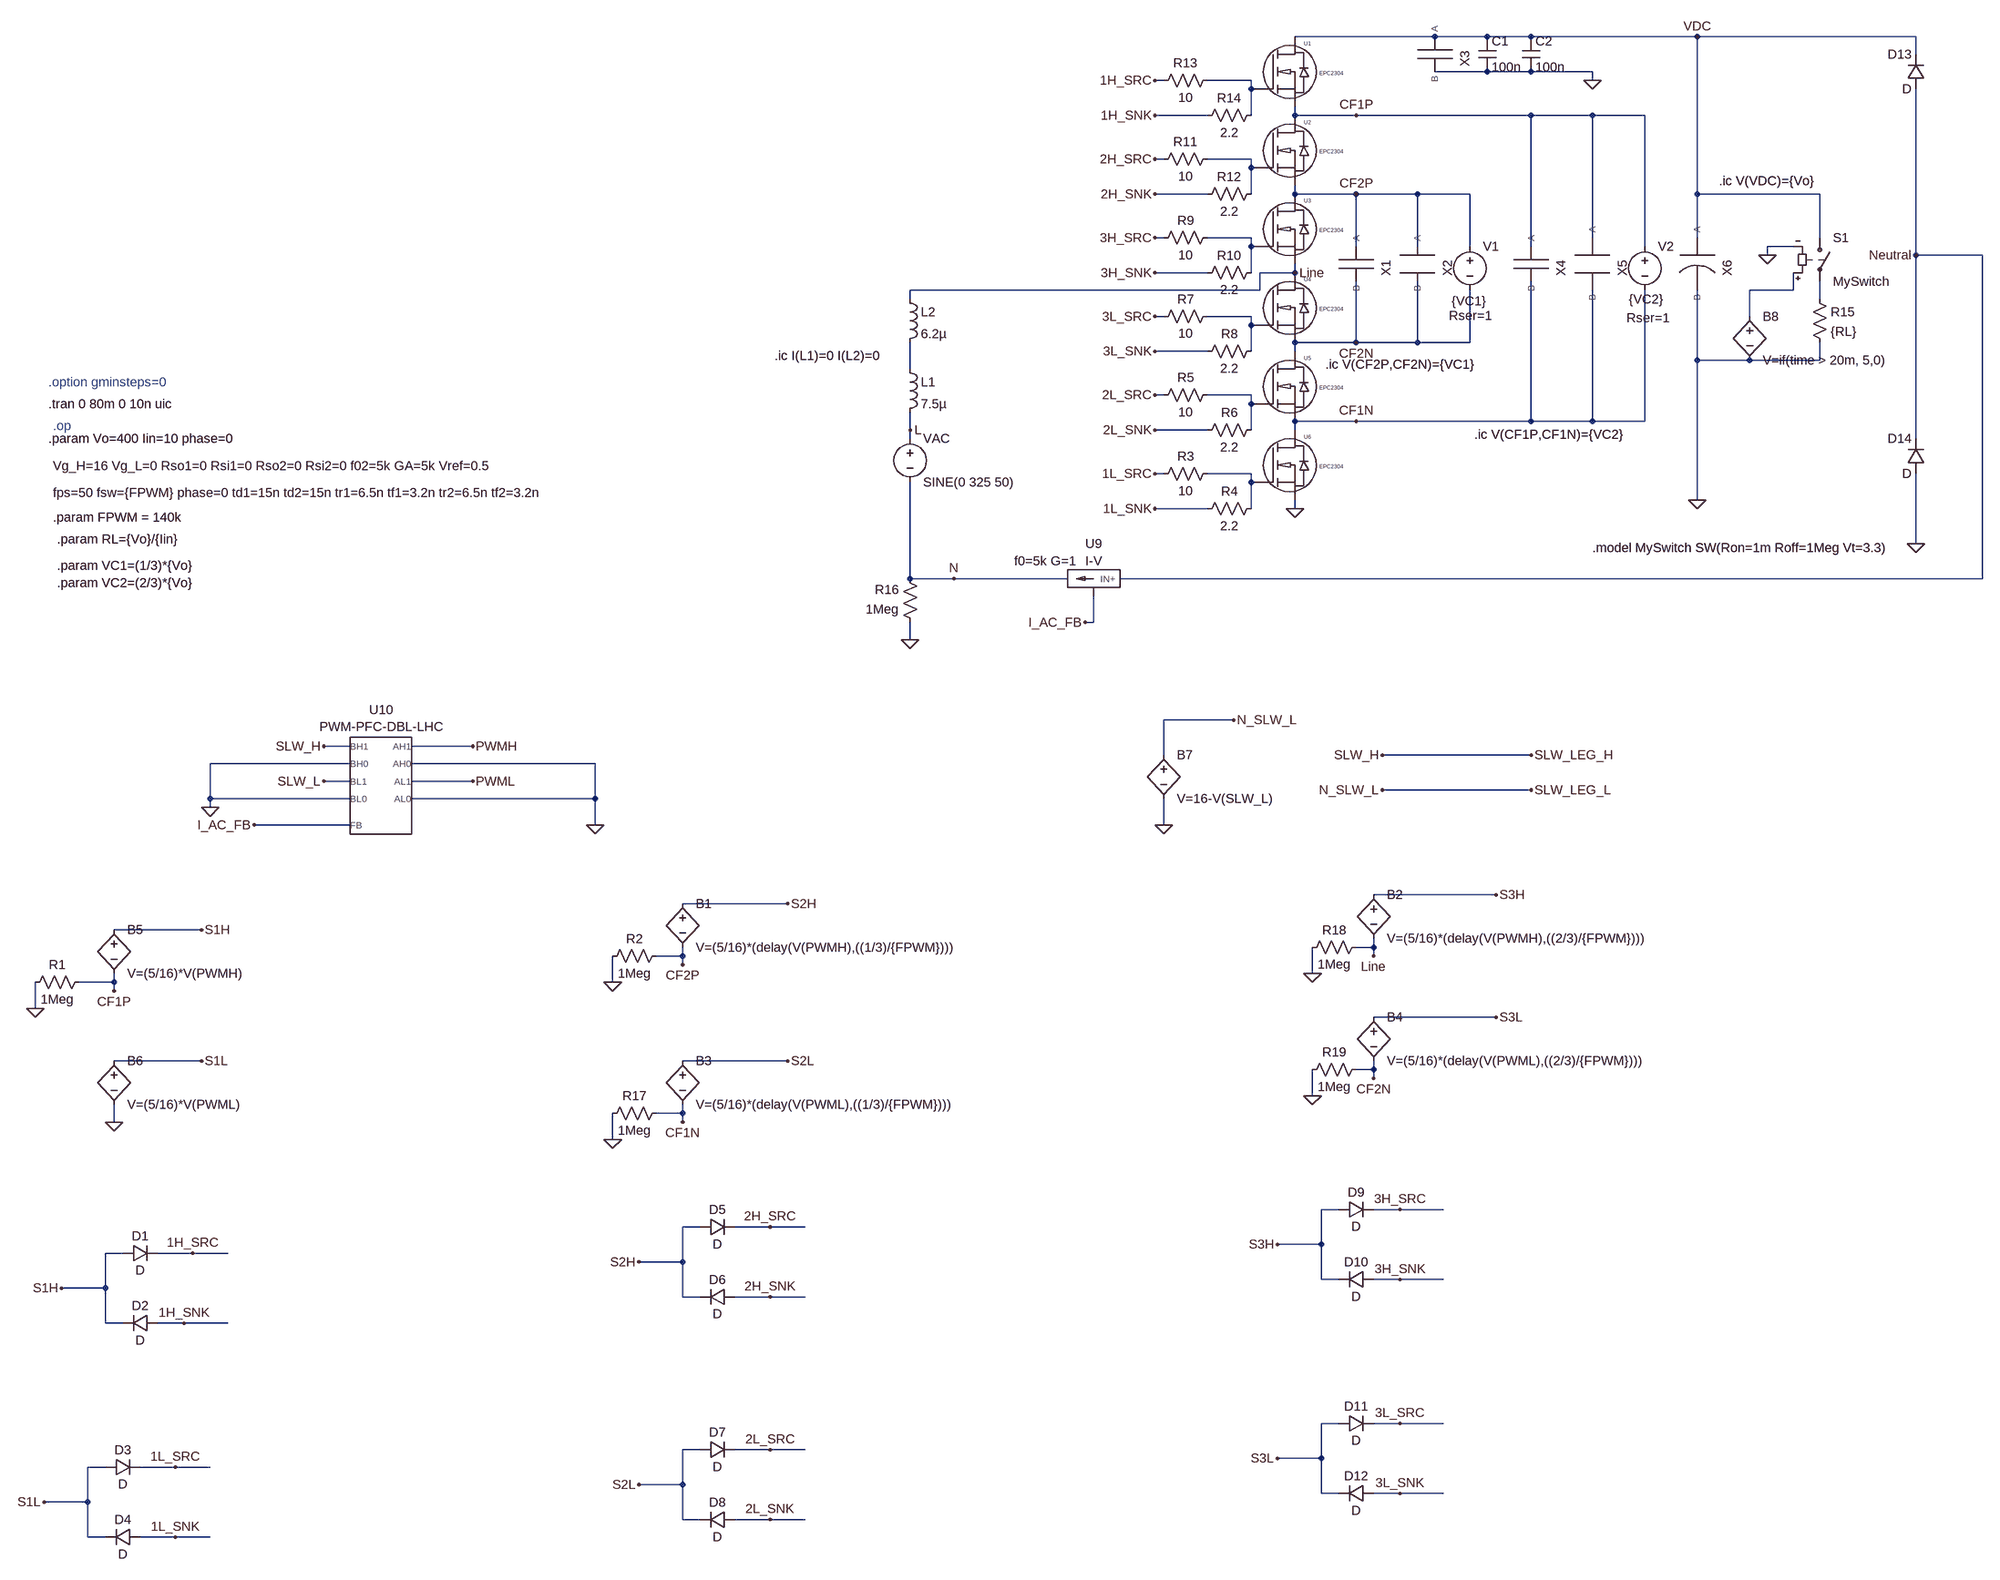
[diagram p0: schematic PFC_ZVS.asc]
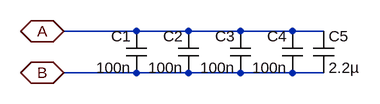
[diagram p1: sub-circuit hf_decoup.asc]
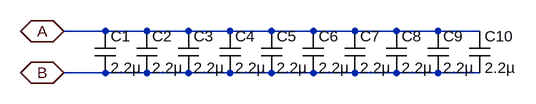
[diagram p2: sub-circuit fl2.asc]
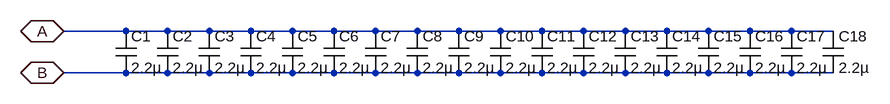
[diagram p3: sub-circuit fl1.asc]
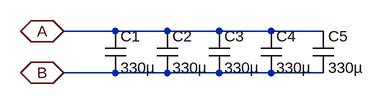
[diagram p4: sub-circuit bulk_cap.asc]
PFC_ZVS.asc, the LTspice schematic file:
Version 4.1
SHEET 1 4276 2968
WIRE 352 0 96 0
WIRE 448 0 352 0
WIRE 528 0 448 0
WIRE 832 0 528 0
WIRE 1232 0 832 0
WIRE 1232 32 1232 0
WIRE 448 64 352 64
WIRE 528 64 448 64
WIRE 640 64 528 64
WIRE -144 80 -160 80
WIRE 16 80 -64 80
WIRE 640 80 640 64
WIRE 16 96 16 80
WIRE -64 144 -160 144
WIRE 16 144 16 96
WIRE 96 144 96 128
WIRE 208 144 96 144
WIRE 528 144 208 144
WIRE 640 144 528 144
WIRE 736 144 640 144
WIRE -144 224 -160 224
WIRE 16 224 -64 224
WIRE 16 240 16 224
WIRE -64 288 -160 288
WIRE 16 288 16 240
WIRE 96 288 96 272
WIRE 208 288 96 288
WIRE 320 288 208 288
WIRE 416 288 320 288
WIRE 832 288 832 0
WIRE 1056 288 832 288
WIRE -144 368 -160 368
WIRE 16 368 -64 368
WIRE 640 368 640 144
WIRE 832 368 832 288
WIRE 1056 368 1056 288
WIRE 16 384 16 368
WIRE 208 384 208 288
WIRE 320 384 320 288
WIRE 416 384 416 288
WIRE 528 384 528 144
WIRE 736 384 736 144
WIRE 1008 384 960 384
WIRE 960 400 960 384
WIRE 1232 400 1232 96
WIRE 1792 400 1232 400
WIRE -64 432 -160 432
WIRE 16 432 16 384
WIRE 96 432 96 416
WIRE 96 432 32 432
WIRE 32 464 32 432
WIRE 32 464 -608 464
WIRE 1008 464 1008 432
WIRE 1008 464 928 464
WIRE -608 480 -608 464
WIRE 1056 480 1056 448
WIRE -144 512 -160 512
WIRE 16 512 -64 512
WIRE 928 512 928 464
WIRE 16 528 16 512
WIRE 208 560 208 448
WIRE 208 560 96 560
WIRE 320 560 320 448
WIRE 320 560 208 560
WIRE 416 560 416 464
WIRE 416 560 320 560
WIRE -64 576 -160 576
WIRE 16 576 16 528
WIRE 96 576 96 560
WIRE 832 592 832 464
WIRE 928 592 832 592
WIRE 1056 592 1056 560
WIRE 1056 592 928 592
WIRE -608 608 -608 560
WIRE -144 656 -160 656
WIRE 16 656 -64 656
WIRE 16 672 16 656
WIRE 208 704 96 704
WIRE 528 704 528 448
WIRE 528 704 208 704
WIRE 640 704 640 464
WIRE 640 704 528 704
WIRE 736 704 736 464
WIRE 736 704 640 704
WIRE -608 720 -608 688
WIRE -64 720 -160 720
WIRE 16 720 16 672
WIRE 96 720 96 704
WIRE -608 736 -608 720
WIRE 1232 736 1232 400
WIRE -144 800 -160 800
WIRE 16 800 -64 800
WIRE 16 816 16 800
WIRE 832 848 832 592
WIRE -64 864 -160 864
WIRE 16 864 16 816
WIRE 96 864 96 848
WIRE 1232 928 1232 800
WIRE -608 992 -608 816
WIRE -528 992 -608 992
WIRE -320 992 -528 992
WIRE 1792 992 1792 400
WIRE 1792 992 -224 992
WIRE -272 1072 -272 1024
WIRE -272 1072 -288 1072
WIRE -608 1104 -608 1072
WIRE -16 1296 -144 1296
WIRE -1632 1344 -1680 1344
WIRE -1408 1344 -1520 1344
WIRE -144 1360 -144 1296
WIRE 528 1360 256 1360
WIRE -1632 1376 -1888 1376
WIRE -1184 1376 -1520 1376
WIRE -1632 1408 -1680 1408
WIRE -1408 1408 -1520 1408
WIRE 528 1424 256 1424
WIRE -1888 1440 -1888 1376
WIRE -1632 1440 -1888 1440
WIRE -1184 1440 -1184 1376
WIRE -1184 1440 -1520 1440
WIRE -1888 1456 -1888 1440
WIRE -1632 1488 -1808 1488
WIRE -1184 1488 -1184 1440
WIRE -144 1488 -144 1440
WIRE 464 1616 240 1616
WIRE -832 1632 -1024 1632
WIRE -1904 1680 -2064 1680
WIRE 240 1712 240 1696
WIRE 240 1712 208 1712
WIRE -1024 1728 -1024 1712
WIRE -1024 1728 -1072 1728
WIRE 240 1728 240 1712
WIRE -1024 1744 -1024 1728
WIRE 128 1760 128 1712
WIRE -2064 1776 -2064 1760
WIRE -2064 1776 -2128 1776
WIRE -1152 1776 -1152 1728
WIRE -2064 1792 -2064 1776
WIRE -2208 1824 -2208 1776
WIRE 464 1840 240 1840
WIRE -1904 1920 -2064 1920
WIRE -832 1920 -1024 1920
WIRE 240 1936 240 1920
WIRE 240 1936 208 1936
WIRE 240 1952 240 1936
WIRE 128 1984 128 1936
WIRE -1024 2016 -1024 2000
WIRE -1024 2016 -1072 2016
WIRE -2064 2032 -2064 2000
WIRE -1024 2032 -1024 2016
WIRE -1152 2064 -1152 2016
WIRE 176 2192 144 2192
WIRE 288 2192 240 2192
WIRE 368 2192 288 2192
WIRE -992 2224 -1024 2224
WIRE -864 2224 -928 2224
WIRE -800 2224 -864 2224
WIRE 144 2256 144 2192
WIRE 144 2256 64 2256
WIRE -2048 2272 -2080 2272
WIRE -1920 2272 -1984 2272
WIRE -1856 2272 -1920 2272
WIRE -1024 2288 -1024 2224
WIRE -1024 2288 -1104 2288
WIRE 144 2320 144 2256
WIRE 176 2320 144 2320
WIRE 288 2320 240 2320
WIRE 368 2320 288 2320
WIRE -2080 2336 -2080 2272
WIRE -2080 2336 -2160 2336
WIRE -1024 2352 -1024 2288
WIRE -992 2352 -1024 2352
WIRE -864 2352 -928 2352
WIRE -800 2352 -864 2352
WIRE -2080 2400 -2080 2336
WIRE -2048 2400 -2080 2400
WIRE -1936 2400 -1984 2400
WIRE -1856 2400 -1936 2400
WIRE 176 2592 144 2592
WIRE 288 2592 240 2592
WIRE 368 2592 288 2592
WIRE -992 2640 -1024 2640
WIRE -864 2640 -928 2640
WIRE -800 2640 -864 2640
WIRE 144 2656 144 2592
WIRE 144 2656 64 2656
WIRE -2080 2672 -2112 2672
WIRE -1952 2672 -2016 2672
WIRE -1888 2672 -1952 2672
WIRE -1024 2704 -1024 2640
WIRE -1024 2704 -1104 2704
WIRE 144 2720 144 2656
WIRE 176 2720 144 2720
WIRE 288 2720 240 2720
WIRE 368 2720 288 2720
WIRE -2112 2736 -2112 2672
WIRE -2112 2736 -2192 2736
WIRE -1024 2768 -1024 2704
WIRE -992 2768 -1024 2768
WIRE -864 2768 -928 2768
WIRE -800 2768 -864 2768
WIRE -2112 2800 -2112 2736
WIRE -2080 2800 -2112 2800
WIRE -1952 2800 -2016 2800
WIRE -1888 2800 -1952 2800
FLAG 96 864 0
FLAG 1232 928 0
FLAG 640 80 0
FLAG 832 848 0
FLAG -288 1072 I_AC_FB
FLAG -1808 1488 I_AC_FB
FLAG -1184 1488 0
FLAG 1232 400 Neutral
FLAG -1408 1344 PWMH
FLAG -1408 1408 PWML
FLAG 208 144 CF1P
FLAG 208 288 CF2P
FLAG 208 560 CF2N
FLAG 208 704 CF1N
FLAG -1904 1680 S1H
FLAG -1904 1920 S1L
FLAG -832 1632 S2H
FLAG -832 1920 S2L
FLAG 464 1616 S3H
FLAG 464 1840 S3L
FLAG -160 80 1H_SRC
FLAG -160 144 1H_SNK
FLAG -160 224 2H_SRC
FLAG -160 288 2H_SNK
FLAG -160 368 3H_SRC
FLAG -160 432 3H_SNK
FLAG -160 512 3L_SRC
FLAG -160 576 3L_SNK
FLAG -160 656 2L_SRC
FLAG -160 720 2L_SNK
FLAG -160 800 1L_SRC
FLAG -160 864 1L_SNK
FLAG -2160 2336 S1H
FLAG -1920 2272 1H_SRC
FLAG -1936 2400 1H_SNK
FLAG -2192 2736 S1L
FLAG -1952 2672 1L_SRC
FLAG -1952 2800 1L_SNK
FLAG -1104 2288 S2H
FLAG -864 2224 2H_SRC
FLAG -864 2352 2H_SNK
FLAG -1104 2704 S2L
FLAG -864 2640 2L_SRC
FLAG -864 2768 2L_SNK
FLAG 64 2256 S3H
FLAG 288 2192 3H_SRC
FLAG 288 2320 3H_SNK
FLAG 96 432 Line
FLAG 64 2656 S3L
FLAG 288 2592 3L_SRC
FLAG 288 2720 3L_SNK
FLAG 832 0 VDC
FLAG 528 1424 SLW_LEG_L
FLAG 528 1360 SLW_LEG_H
FLAG -1888 1456 0
FLAG -1680 1344 SLW_H
FLAG -1680 1408 SLW_L
FLAG 256 1360 SLW_H
FLAG -144 1488 0
FLAG -16 1296 N_SLW_L
FLAG 256 1424 N_SLW_L
FLAG -608 720 L
FLAG -528 992 N
FLAG -608 1104 0
FLAG -1024 2032 CF1N
FLAG -2064 2032 0
FLAG 240 1952 CF2N
FLAG 240 1728 Line
FLAG -1024 1744 CF2P
FLAG -2064 1792 CF1P
FLAG -2208 1824 0
FLAG -1152 1776 0
FLAG -1152 2064 0
FLAG 128 1760 0
FLAG 128 1984 0
FLAG 960 400 0
SYMBOL EPCGaN 16 96 R0
SYMATTR InstName U1
SYMBOL EPCGaN 16 240 R0
SYMATTR InstName U2
SYMBOL EPCGaN 16 384 R0
SYMATTR InstName U3
SYMBOL EPCGaN 16 528 R0
SYMATTR InstName U4
SYMBOL EPCGaN 16 672 R0
SYMATTR InstName U5
SYMBOL EPCGaN 16 816 R0
SYMATTR InstName U6
SYMBOL voltage -608 720 R0
WINDOW 123 0 0 Left 0
WINDOW 39 24 124 Left 2
SYMATTR InstName VAC
SYMATTR Value SINE(0 325 50)
SYMBOL ind -624 592 R0
SYMATTR InstName L1
SYMATTR Value 7.5µ
SYMATTR SpiceLine Ipk=96 Rser=2.11m Rpar=3.209k Cpar=4p
SYMBOL HF_decoup 208 416 R90
SYMATTR InstName X1
SYMBOL FL2 320 416 R90
SYMATTR InstName X2
SYMBOL HF_decoup 352 32 R90
SYMATTR InstName X3
SYMBOL cap 432 0 R0
SYMATTR InstName C1
SYMATTR Value 100n
SYMATTR SpiceLine V=450 Rser=0.0242 Lser=0.75n Rpar=5Giga
SYMBOL cap 512 0 R0
SYMATTR InstName C2
SYMATTR Value 100n
SYMATTR SpiceLine V=450 Rser=0.0242 Lser=0.75n Rpar=5Giga
SYMBOL HF_decoup 528 416 R90
SYMATTR InstName X4
SYMBOL FL1 640 416 R90
SYMATTR InstName X5
SYMBOL Bulk_cap 832 416 R90
SYMATTR InstName X6
SYMBOL I-V -288 992 M0
SYMATTR InstName U9
SYMBOL ind -624 464 R0
SYMATTR InstName L2
SYMATTR Value 6.2µ
SYMATTR SpiceLine Ipk=74 Rser=1.05m Rpar=1.5k Cpar=6.5p
SYMBOL PWM-PFC-DBL-LHC -1584 1472 R0
WINDOW 39 -592 -637 Left 2
WINDOW 40 -592 -686 Left 2
SYMATTR SpiceLine fps=50 fsw={FPWM} phase=0 td1=15n td2=15n tr1=6.5n tf1=3.2n tr2=6.5n tf2=3.2n
SYMATTR SpiceLine2 Vg_H=16 Vg_L=0 Rso1=0 Rsi1=0 Rso2=0 Rsi2=0 f02=5k GA=5k Vref=0.5
SYMATTR InstName U10
SYMBOL bv -1024 1616 R0
SYMATTR InstName B1
SYMATTR Value V=(5/16)*(delay(V(PWMH),((1/3)/{FPWM})))
SYMBOL res -48 784 R90
WINDOW 0 0 56 VBottom 2
WINDOW 3 32 56 VTop 2
SYMATTR InstName R3
SYMATTR Value 10
SYMBOL res 32 848 R90
WINDOW 0 0 56 VBottom 2
WINDOW 3 32 56 VTop 2
SYMATTR InstName R4
SYMATTR Value 2.2
SYMBOL res -48 640 R90
WINDOW 0 0 56 VBottom 2
WINDOW 3 32 56 VTop 2
SYMATTR InstName R5
SYMATTR Value 10
SYMBOL res 32 704 R90
WINDOW 0 0 56 VBottom 2
WINDOW 3 32 56 VTop 2
SYMATTR InstName R6
SYMATTR Value 2.2
SYMBOL res -48 496 R90
WINDOW 0 0 56 VBottom 2
WINDOW 3 32 56 VTop 2
SYMATTR InstName R7
SYMATTR Value 10
SYMBOL res 32 560 R90
WINDOW 0 0 56 VBottom 2
WINDOW 3 32 56 VTop 2
SYMATTR InstName R8
SYMATTR Value 2.2
SYMBOL res -48 352 R90
WINDOW 0 0 56 VBottom 2
WINDOW 3 32 56 VTop 2
SYMATTR InstName R9
SYMATTR Value 10
SYMBOL res 32 416 R90
WINDOW 0 0 56 VBottom 2
WINDOW 3 32 56 VTop 2
SYMATTR InstName R10
SYMATTR Value 2.2
SYMBOL res -48 208 R90
WINDOW 0 0 56 VBottom 2
WINDOW 3 32 56 VTop 2
SYMATTR InstName R11
SYMATTR Value 10
SYMBOL res 32 272 R90
WINDOW 0 0 56 VBottom 2
WINDOW 3 32 56 VTop 2
SYMATTR InstName R12
SYMATTR Value 2.2
SYMBOL res -48 64 R90
WINDOW 0 0 56 VBottom 2
WINDOW 3 32 56 VTop 2
SYMATTR InstName R13
SYMATTR Value 10
SYMBOL res 32 128 R90
WINDOW 0 0 56 VBottom 2
WINDOW 3 32 56 VTop 2
SYMATTR InstName R14
SYMATTR Value 2.2
SYMBOL bv -1024 1904 R0
SYMATTR InstName B3
SYMATTR Value V=(5/16)*(delay(V(PWML),((1/3)/{FPWM})))
SYMBOL bv 240 1600 R0
SYMATTR InstName B2
SYMATTR Value V=(5/16)*(delay(V(PWMH),((2/3)/{FPWM})))
SYMBOL bv 240 1824 R0
SYMATTR InstName B4
SYMATTR Value V=(5/16)*(delay(V(PWML),((2/3)/{FPWM})))
SYMBOL bv -2064 1664 R0
SYMATTR InstName B5
SYMATTR Value V=(5/16)*V(PWMH)
SYMBOL bv -2064 1904 R0
SYMATTR InstName B6
SYMATTR Value V=(5/16)*V(PWML)
SYMBOL res 1040 464 R0
SYMATTR InstName R15
SYMATTR Value {RL}
SYMBOL bv -144 1344 R0
SYMATTR InstName B7
SYMATTR Value V=16-V(SLW_L)
SYMBOL res -592 1088 R180
WINDOW 0 36 76 Left 2
WINDOW 3 36 40 Left 2
SYMATTR InstName R16
SYMATTR Value 1Meg
SYMBOL diode -2048 2288 R270
WINDOW 0 32 32 VTop 2
WINDOW 3 0 32 VBottom 2
SYMATTR InstName D1
SYMBOL diode -1984 2384 R90
WINDOW 0 0 32 VBottom 2
WINDOW 3 32 32 VTop 2
SYMATTR InstName D2
SYMBOL diode -2080 2688 R270
WINDOW 0 32 32 VTop 2
WINDOW 3 0 32 VBottom 2
SYMATTR InstName D3
SYMBOL diode -2016 2784 R90
WINDOW 0 0 32 VBottom 2
WINDOW 3 32 32 VTop 2
SYMATTR InstName D4
SYMBOL diode -992 2240 R270
WINDOW 0 32 32 VTop 2
WINDOW 3 0 32 VBottom 2
SYMATTR InstName D5
SYMBOL diode -928 2336 R90
WINDOW 0 0 32 VBottom 2
WINDOW 3 32 32 VTop 2
SYMATTR InstName D6
SYMBOL diode -992 2656 R270
WINDOW 0 32 32 VTop 2
WINDOW 3 0 32 VBottom 2
SYMATTR InstName D7
SYMBOL diode -928 2752 R90
WINDOW 0 0 32 VBottom 2
WINDOW 3 32 32 VTop 2
SYMATTR InstName D8
SYMBOL diode 176 2208 R270
WINDOW 0 32 32 VTop 2
WINDOW 3 0 32 VBottom 2
SYMATTR InstName D9
SYMBOL diode 240 2304 R90
WINDOW 0 0 32 VBottom 2
WINDOW 3 32 32 VTop 2
SYMATTR InstName D10
SYMBOL diode 176 2608 R270
WINDOW 0 32 32 VTop 2
WINDOW 3 0 32 VBottom 2
SYMATTR InstName D11
SYMBOL diode 240 2704 R90
WINDOW 0 0 32 VBottom 2
WINDOW 3 32 32 VTop 2
SYMATTR InstName D12
SYMBOL diode 1248 96 R180
WINDOW 0 24 64 Left 2
WINDOW 3 24 0 Left 2
SYMATTR InstName D13
SYMBOL diode 1248 800 R180
WINDOW 0 24 64 Left 2
WINDOW 3 24 0 Left 2
SYMATTR InstName D14
SYMBOL res -2112 1760 R90
WINDOW 0 0 56 VBottom 2
WINDOW 3 32 56 VTop 2
SYMATTR InstName R1
SYMATTR Value 1Meg
SYMBOL res -1056 1712 R90
WINDOW 0 0 56 VBottom 2
WINDOW 3 32 56 VTop 2
SYMATTR InstName R2
SYMATTR Value 1Meg
SYMBOL res -1056 2000 R90
WINDOW 0 0 56 VBottom 2
WINDOW 3 32 56 VTop 2
SYMATTR InstName R17
SYMATTR Value 1Meg
SYMBOL res 224 1696 R90
WINDOW 0 0 56 VBottom 2
WINDOW 3 32 56 VTop 2
SYMATTR InstName R18
SYMATTR Value 1Meg
SYMBOL res 224 1920 R90
WINDOW 0 0 56 VBottom 2
WINDOW 3 32 56 VTop 2
SYMATTR InstName R19
SYMATTR Value 1Meg
SYMBOL sw 1056 352 R0
SYMATTR InstName S1
SYMATTR Value MySwitch
SYMBOL bv 928 496 R0
SYMATTR InstName B8
SYMATTR Value V=if(time > 20m, 5,0)
SYMBOL voltage 416 368 R0
WINDOW 3 -33 116 Left 2
WINDOW 123 0 0 Left 0
WINDOW 39 -38 143 Left 2
SYMATTR InstName V1
SYMATTR Value {VC1}
SYMATTR SpiceLine Rser=1
SYMBOL voltage 736 368 R0
WINDOW 3 -29 113 Left 2
WINDOW 123 0 0 Left 0
WINDOW 39 -33 147 Left 2
SYMATTR InstName V2
SYMATTR Value {VC2}
SYMATTR SpiceLine Rser=1
TEXT -2184 672 Left 2 !.tran 0 80m 0 10n uic
TEXT 152 600 Left 2 !.ic V(CF2P,CF2N)={VC1}
TEXT 424 728 Left 2 !.ic V(CF1P,CF1N)={VC2}
TEXT 872 264 Left 2 !.ic V(VDC)={Vo}
TEXT -856 584 Left 2 !.ic I(L1)=0 I(L2)=0
TEXT -2176 712 Left 2 ;.op
TEXT -2184 736 Left 2 !.param Vo=400 Iin=10 phase=0
TEXT -2176 880 Left 2 !.param FPWM = 140k
TEXT -2184 632 Left 2 ;.option gminsteps=0
TEXT -2168 920 Left 2 !.param RL={Vo}/{Iin}
TEXT 640 936 Left 2 !.model MySwitch SW(Ron=1m Roff=1Meg Vt=3.3)
TEXT -2168 968 Left 2 !.param VC1=(1/3)*{Vo}
TEXT -2168 1000 Left 2 !.param VC2=(2/3)*{Vo}

hf_decoup.asc, the sub-circuit schematic file:
Version 4.1
SHEET 1 880 680
WIRE 192 96 80 96
WIRE 272 96 192 96
WIRE 352 96 272 96
WIRE 432 96 352 96
WIRE 480 96 432 96
WIRE 192 160 80 160
WIRE 272 160 192 160
WIRE 352 160 272 160
WIRE 432 160 352 160
WIRE 480 160 432 160
FLAG 80 96 A
IOPIN 80 96 BiDir
FLAG 80 160 B
IOPIN 80 160 BiDir
SYMBOL cap 208 160 R180
WINDOW 0 24 56 Left 2
WINDOW 3 24 8 Left 2
SYMATTR InstName C1
SYMATTR Value 100n
SYMATTR SpiceLine V=450 Rser=0.0242 Lser=0.75n Rpar=5G
SYMBOL cap 288 160 R180
WINDOW 0 24 56 Left 2
WINDOW 3 24 8 Left 2
SYMATTR InstName C2
SYMATTR Value 100n
SYMATTR SpiceLine V=450 Rser=0.0242 Lser=0.75n Rpar=5G
SYMBOL cap 368 160 R180
WINDOW 0 24 56 Left 2
WINDOW 3 24 8 Left 2
SYMATTR InstName C3
SYMATTR Value 100n
SYMATTR SpiceLine V=450 Rser=0.0242 Lser=0.75n Rpar=5G
SYMBOL cap 448 160 R180
WINDOW 0 24 56 Left 2
WINDOW 3 24 8 Left 2
SYMATTR InstName C4
SYMATTR Value 100n
SYMATTR SpiceLine V=450 Rser=0.0242 Lser=0.75n Rpar=5G
SYMBOL cap 464 96 R0
SYMATTR InstName C5
SYMATTR Value 2.2µ
SYMATTR SpiceLine V=450 Rser=0.0043 Lser=0.65n Rpar=0.227G

fl2.asc, the sub-circuit schematic file:
Version 4.1
SHEET 1 880 680
WIRE 128 96 64 96
WIRE 192 96 128 96
WIRE 256 96 192 96
WIRE 320 96 256 96
WIRE 384 96 320 96
WIRE 448 96 384 96
WIRE 512 96 448 96
WIRE 576 96 512 96
WIRE 640 96 576 96
WIRE 704 96 640 96
WIRE 128 160 64 160
WIRE 192 160 128 160
WIRE 256 160 192 160
WIRE 320 160 256 160
WIRE 384 160 320 160
WIRE 448 160 384 160
WIRE 512 160 448 160
WIRE 576 160 512 160
WIRE 640 160 576 160
WIRE 704 160 640 160
FLAG 64 96 A
IOPIN 64 96 BiDir
FLAG 64 160 B
IOPIN 64 160 BiDir
SYMBOL cap 112 96 R0
SYMATTR InstName C1
SYMATTR Value 2.2µ
SYMATTR SpiceLine V=450 Rser=0.0043 Lser=0.65n Rpar=0.227G
SYMBOL cap 176 96 R0
SYMATTR InstName C2
SYMATTR Value 2.2µ
SYMATTR SpiceLine V=450 Rser=0.0043 Lser=0.65n Rpar=0.227G
SYMBOL cap 240 96 R0
SYMATTR InstName C3
SYMATTR Value 2.2µ
SYMATTR SpiceLine V=450 Rser=0.0043 Lser=0.65n Rpar=0.227G
SYMBOL cap 304 96 R0
SYMATTR InstName C4
SYMATTR Value 2.2µ
SYMATTR SpiceLine V=450 Rser=0.0043 Lser=0.65n Rpar=0.227G
SYMBOL cap 368 96 R0
SYMATTR InstName C5
SYMATTR Value 2.2µ
SYMATTR SpiceLine V=450 Rser=0.0043 Lser=0.65n Rpar=0.227G
SYMBOL cap 432 96 R0
SYMATTR InstName C6
SYMATTR Value 2.2µ
SYMATTR SpiceLine V=450 Rser=0.0043 Lser=0.65n Rpar=0.227G
SYMBOL cap 496 96 R0
SYMATTR InstName C7
SYMATTR Value 2.2µ
SYMATTR SpiceLine V=450 Rser=0.0043 Lser=0.65n Rpar=0.227G
SYMBOL cap 560 96 R0
SYMATTR InstName C8
SYMATTR Value 2.2µ
SYMATTR SpiceLine V=450 Rser=0.0043 Lser=0.65n Rpar=0.227G
SYMBOL cap 624 96 R0
SYMATTR InstName C9
SYMATTR Value 2.2µ
SYMATTR SpiceLine V=450 Rser=0.0043 Lser=0.65n Rpar=0.227G
SYMBOL cap 688 96 R0
SYMATTR InstName C10
SYMATTR Value 2.2µ
SYMATTR SpiceLine V=450 Rser=0.0043 Lser=0.65n Rpar=0.227G

fl1.asc, the sub-circuit schematic file:
Version 4.1
SHEET 1 1280 680
WIRE 128 112 32 112
WIRE 192 112 128 112
WIRE 256 112 192 112
WIRE 320 112 256 112
WIRE 384 112 320 112
WIRE 448 112 384 112
WIRE 512 112 448 112
WIRE 576 112 512 112
WIRE 640 112 576 112
WIRE 704 112 640 112
WIRE 768 112 704 112
WIRE 832 112 768 112
WIRE 896 112 832 112
WIRE 960 112 896 112
WIRE 1024 112 960 112
WIRE 1088 112 1024 112
WIRE 1152 112 1088 112
WIRE 1216 112 1152 112
WIRE 128 176 32 176
WIRE 192 176 128 176
WIRE 256 176 192 176
WIRE 320 176 256 176
WIRE 384 176 320 176
WIRE 448 176 384 176
WIRE 512 176 448 176
WIRE 576 176 512 176
WIRE 640 176 576 176
WIRE 704 176 640 176
WIRE 768 176 704 176
WIRE 832 176 768 176
WIRE 896 176 832 176
WIRE 960 176 896 176
WIRE 1024 176 960 176
WIRE 1088 176 1024 176
WIRE 1152 176 1088 176
WIRE 1216 176 1152 176
FLAG 32 112 A
IOPIN 32 112 BiDir
FLAG 32 176 B
IOPIN 32 176 BiDir
SYMBOL cap 112 112 R0
SYMATTR InstName C1
SYMATTR Value 2.2µ
SYMATTR SpiceLine V=450 Rser=0.0043 Lser=0.65n Rpar=0.227G
SYMBOL cap 176 112 R0
SYMATTR InstName C2
SYMATTR Value 2.2µ
SYMATTR SpiceLine V=450 Rser=0.0043 Lser=0.65n Rpar=0.227G
SYMBOL cap 240 112 R0
SYMATTR InstName C3
SYMATTR Value 2.2µ
SYMATTR SpiceLine V=450 Rser=0.0043 Lser=0.65n Rpar=0.227G
SYMBOL cap 304 112 R0
SYMATTR InstName C4
SYMATTR Value 2.2µ
SYMATTR SpiceLine V=450 Rser=0.0043 Lser=0.65n Rpar=0.227G
SYMBOL cap 368 112 R0
SYMATTR InstName C5
SYMATTR Value 2.2µ
SYMATTR SpiceLine V=450 Rser=0.0043 Lser=0.65n Rpar=0.227G
SYMBOL cap 432 112 R0
SYMATTR InstName C6
SYMATTR Value 2.2µ
SYMATTR SpiceLine V=450 Rser=0.0043 Lser=0.65n Rpar=0.227G
SYMBOL cap 496 112 R0
SYMATTR InstName C7
SYMATTR Value 2.2µ
SYMATTR SpiceLine V=450 Rser=0.0043 Lser=0.65n Rpar=0.227G
SYMBOL cap 560 112 R0
SYMATTR InstName C8
SYMATTR Value 2.2µ
SYMATTR SpiceLine V=450 Rser=0.0043 Lser=0.65n Rpar=0.227G
SYMBOL cap 624 112 R0
SYMATTR InstName C9
SYMATTR Value 2.2µ
SYMATTR SpiceLine V=450 Rser=0.0043 Lser=0.65n Rpar=0.227G
SYMBOL cap 688 112 R0
SYMATTR InstName C10
SYMATTR Value 2.2µ
SYMATTR SpiceLine V=450 Rser=0.0043 Lser=0.65n Rpar=0.227G
SYMBOL cap 752 112 R0
SYMATTR InstName C11
SYMATTR Value 2.2µ
SYMATTR SpiceLine V=450 Rser=0.0043 Lser=0.65n Rpar=0.227G
SYMBOL cap 816 112 R0
SYMATTR InstName C12
SYMATTR Value 2.2µ
SYMATTR SpiceLine V=450 Rser=0.0043 Lser=0.65n Rpar=0.227G
SYMBOL cap 880 112 R0
SYMATTR InstName C13
SYMATTR Value 2.2µ
SYMATTR SpiceLine V=450 Rser=0.0043 Lser=0.65n Rpar=0.227G
SYMBOL cap 944 112 R0
SYMATTR InstName C14
SYMATTR Value 2.2µ
SYMATTR SpiceLine V=450 Rser=0.0043 Lser=0.65n Rpar=0.227G
SYMBOL cap 1008 112 R0
SYMATTR InstName C15
SYMATTR Value 2.2µ
SYMATTR SpiceLine V=450 Rser=0.0043 Lser=0.65n Rpar=0.227G
SYMBOL cap 1072 112 R0
SYMATTR InstName C16
SYMATTR Value 2.2µ
SYMATTR SpiceLine V=450 Rser=0.0043 Lser=0.65n Rpar=0.227G
SYMBOL cap 1136 112 R0
SYMATTR InstName C17
SYMATTR Value 2.2µ
SYMATTR SpiceLine V=450 Rser=0.0043 Lser=0.65n Rpar=0.227G
SYMBOL cap 1200 112 R0
SYMATTR InstName C18
SYMATTR Value 2.2µ
SYMATTR SpiceLine V=450 Rser=0.0043 Lser=0.65n Rpar=0.227G

bulk_cap.asc, the sub-circuit schematic file:
Version 4.1
SHEET 1 880 680
WIRE 144 128 64 128
WIRE 224 128 144 128
WIRE 304 128 224 128
WIRE 384 128 304 128
WIRE 464 128 384 128
WIRE 144 192 64 192
WIRE 224 192 144 192
WIRE 304 192 224 192
WIRE 384 192 304 192
WIRE 464 192 384 192
FLAG 64 128 A
IOPIN 64 128 BiDir
FLAG 64 192 B
IOPIN 64 192 BiDir
SYMBOL cap 128 128 R0
SYMATTR InstName C1
SYMATTR Value 330µ
SYMATTR SpiceLine V=450 Rser=0.3m Lser=25n Rpar=1Meg
SYMBOL cap 208 128 R0
SYMATTR InstName C2
SYMATTR Value 330µ
SYMATTR SpiceLine V=450 Rser=0.3m Lser=25n Rpar=1Meg
SYMBOL cap 288 128 R0
SYMATTR InstName C3
SYMATTR Value 330µ
SYMATTR SpiceLine V=450 Rser=0.3m Lser=25n Rpar=1Meg
SYMBOL cap 368 128 R0
SYMATTR InstName C4
SYMATTR Value 330µ
SYMATTR SpiceLine V=450 Rser=0.3m Lser=25n Rpar=1Meg
SYMBOL cap 448 128 R0
SYMATTR InstName C5
SYMATTR Value 330µ
SYMATTR SpiceLine V=450 Rser=0.3m Lser=25n Rpar=1Meg

The netlist it stands for:
* PFC_ZVS.asc
X§U1 N001 VDC CF1P EPC2304  ; pins gatein drainin sourcein
X§U2 N002 CF1P CF2P EPC2304  ; pins gatein drainin sourcein
X§U3 N003 CF2P Line EPC2304  ; pins gatein drainin sourcein
X§U4 N006 Line CF2N EPC2304  ; pins gatein drainin sourcein
X§U5 N008 CF2N CF1N EPC2304  ; pins gatein drainin sourcein
X§U6 N009 CF1N 0 EPC2304  ; pins gatein drainin sourcein
VAC L N SINE(0 325 50)
L1 N007 L 7.5µ Ipk=96 Rser=2.11m Rpar=3.209k Cpar=4p
X§X1 CF2P CF2N hf_decoup
X§X2 CF2P CF2N fl2
X§X3 VDC 0 hf_decoup
C1 VDC 0 100n V=450 Rser=0.0242 Lser=0.75n Rpar=5Giga
C2 VDC 0 100n V=450 Rser=0.0242 Lser=0.75n Rpar=5Giga
X§X4 CF1P CF1N hf_decoup
X§X5 CF1P CF1N fl1
X§X6 VDC 0 bulk_cap
X§U9 Neutral N I_AC_FB I-V f0=5k G=1  ; pins IN+ IN- OUT
L2 Line N007 6.2µ Ipk=74 Rser=1.05m Rpar=1.5k Cpar=6.5p
X§U10 PWMH 0 PWML 0 SLW_H 0 SLW_L 0 I_AC_FB PWM-PFC-DBL-LHC fps=50 fsw={FPWM} phase=0 td1=15n td2=15n tr1=6.5n tf1=3.2n tr2=6.5n tf2=3.2n Vg_H=16 Vg_L=0 Rso1=0 Rsi1=0 Rso2=0 Rsi2=0 f02=5k GA=5k Vref=0.5  ; pins AH1 AH0 AL1 AL0 BH1 BH0 BL1 BL0 FB
B1 S2H CF2P V=(5/16)*(delay(V(PWMH),((1/3)/{FPWM})))
R3 N009 1L_SRC 10
R4 N009 1L_SNK 2.2
R5 N008 2L_SRC 10
R6 N008 2L_SNK 2.2
R7 N006 3L_SRC 10
R8 N006 3L_SNK 2.2
R9 N003 3H_SRC 10
R10 N003 3H_SNK 2.2
R11 N002 2H_SRC 10
R12 N002 2H_SNK 2.2
R13 N001 1H_SRC 10
R14 N001 1H_SNK 2.2
B3 S2L CF1N V=(5/16)*(delay(V(PWML),((1/3)/{FPWM})))
B2 S3H Line V=(5/16)*(delay(V(PWMH),((2/3)/{FPWM})))
B4 S3L CF2N V=(5/16)*(delay(V(PWML),((2/3)/{FPWM})))
B5 S1H CF1P V=(5/16)*V(PWMH)
B6 S1L 0 V=(5/16)*V(PWML)
R15 N005 0 {RL}
B7 N_SLW_L 0 V=16-V(SLW_L)
R16 0 N 1Meg
D1 S1H 1H_SRC D
D2 1H_SNK S1H D
D3 S1L 1L_SRC D
D4 1L_SNK S1L D
D5 S2H 2H_SRC D
D6 2H_SNK S2H D
D7 S2L 2L_SRC D
D8 2L_SNK S2L D
D9 S3H 3H_SRC D
D10 3H_SNK S3H D
D11 S3L 3L_SRC D
D12 3L_SNK S3L D
D13 Neutral VDC D
D14 0 Neutral D
R1 CF1P 0 1Meg
R2 CF2P 0 1Meg
R17 CF1N 0 1Meg
R18 Line 0 1Meg
R19 CF2N 0 1Meg
S1 VDC N005 N004 0 MySwitch
B8 N004 0 V=if(time > 20m, 5,0)
V1 CF2P CF2N {VC1} Rser=1
V2 CF1P CF1N {VC2} Rser=1

* block symbol definitions
.subckt hf_decoup A B
C1 B A 100n V=450 Rser=0.0242 Lser=0.75n Rpar=5G
C2 B A 100n V=450 Rser=0.0242 Lser=0.75n Rpar=5G
C3 B A 100n V=450 Rser=0.0242 Lser=0.75n Rpar=5G
C4 B A 100n V=450 Rser=0.0242 Lser=0.75n Rpar=5G
C5 A B 2.2µ V=450 Rser=0.0043 Lser=0.65n Rpar=0.227G
.ends hf_decoup

.subckt fl2 A B
C1 A B 2.2µ V=450 Rser=0.0043 Lser=0.65n Rpar=0.227G
C2 A B 2.2µ V=450 Rser=0.0043 Lser=0.65n Rpar=0.227G
C3 A B 2.2µ V=450 Rser=0.0043 Lser=0.65n Rpar=0.227G
C4 A B 2.2µ V=450 Rser=0.0043 Lser=0.65n Rpar=0.227G
C5 A B 2.2µ V=450 Rser=0.0043 Lser=0.65n Rpar=0.227G
C6 A B 2.2µ V=450 Rser=0.0043 Lser=0.65n Rpar=0.227G
C7 A B 2.2µ V=450 Rser=0.0043 Lser=0.65n Rpar=0.227G
C8 A B 2.2µ V=450 Rser=0.0043 Lser=0.65n Rpar=0.227G
C9 A B 2.2µ V=450 Rser=0.0043 Lser=0.65n Rpar=0.227G
C10 A B 2.2µ V=450 Rser=0.0043 Lser=0.65n Rpar=0.227G
.ends fl2

.subckt fl1 A B
C1 A B 2.2µ V=450 Rser=0.0043 Lser=0.65n Rpar=0.227G
C2 A B 2.2µ V=450 Rser=0.0043 Lser=0.65n Rpar=0.227G
C3 A B 2.2µ V=450 Rser=0.0043 Lser=0.65n Rpar=0.227G
C4 A B 2.2µ V=450 Rser=0.0043 Lser=0.65n Rpar=0.227G
C5 A B 2.2µ V=450 Rser=0.0043 Lser=0.65n Rpar=0.227G
C6 A B 2.2µ V=450 Rser=0.0043 Lser=0.65n Rpar=0.227G
C7 A B 2.2µ V=450 Rser=0.0043 Lser=0.65n Rpar=0.227G
C8 A B 2.2µ V=450 Rser=0.0043 Lser=0.65n Rpar=0.227G
C9 A B 2.2µ V=450 Rser=0.0043 Lser=0.65n Rpar=0.227G
C10 A B 2.2µ V=450 Rser=0.0043 Lser=0.65n Rpar=0.227G
C11 A B 2.2µ V=450 Rser=0.0043 Lser=0.65n Rpar=0.227G
C12 A B 2.2µ V=450 Rser=0.0043 Lser=0.65n Rpar=0.227G
C13 A B 2.2µ V=450 Rser=0.0043 Lser=0.65n Rpar=0.227G
C14 A B 2.2µ V=450 Rser=0.0043 Lser=0.65n Rpar=0.227G
C15 A B 2.2µ V=450 Rser=0.0043 Lser=0.65n Rpar=0.227G
C16 A B 2.2µ V=450 Rser=0.0043 Lser=0.65n Rpar=0.227G
C17 A B 2.2µ V=450 Rser=0.0043 Lser=0.65n Rpar=0.227G
C18 A B 2.2µ V=450 Rser=0.0043 Lser=0.65n Rpar=0.227G
.ends fl1

.subckt bulk_cap A B
C1 A B 330µ V=450 Rser=0.3m Lser=25n Rpar=1Meg
C2 A B 330µ V=450 Rser=0.3m Lser=25n Rpar=1Meg
C3 A B 330µ V=450 Rser=0.3m Lser=25n Rpar=1Meg
C4 A B 330µ V=450 Rser=0.3m Lser=25n Rpar=1Meg
C5 A B 330µ V=450 Rser=0.3m Lser=25n Rpar=1Meg
.ends bulk_cap

.model D D
.lib standard.dio
.tran 0 80m 0 10n uic
.ic V(CF2P,CF2N)={VC1}
.ic V(CF1P,CF1N)={VC2}
.ic V(VDC)={Vo}
.ic I(L1)=0 I(L2)=0
* .op
.param Vo=400 Iin=10 phase=0
.param FPWM = 140k
* .option gminsteps=0
.param RL={Vo}/{Iin}
.model MySwitch SW(Ron=1m Roff=1Meg Vt=3.3)
.param VC1=(1/3)*{Vo}
.param VC2=(2/3)*{Vo}
.lib EPCGanlibrary.lib
.lib SS I-V.lib
.lib SS PWM-PFC-DBL-LHC.lib
.backanno
.end